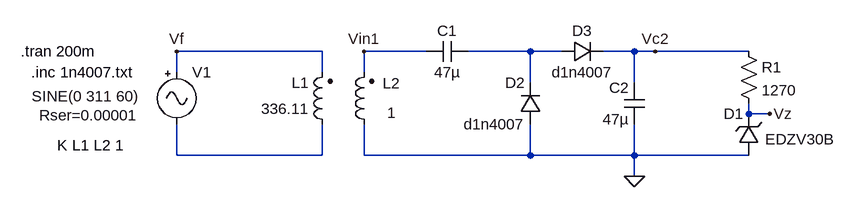
[diagram p0: schematic diodo zener.asc]
diodo zener.asc, the LTspice schematic file:
Version 4
SHEET 1 880 680
WIRE -416 144 -640 144
WIRE -256 144 -352 144
WIRE -96 144 -192 144
WIRE -48 144 -96 144
WIRE 64 144 16 144
WIRE 96 144 64 144
WIRE 240 144 96 144
WIRE -640 176 -640 144
WIRE -416 176 -416 144
WIRE -352 176 -352 144
WIRE -96 192 -96 144
WIRE 64 192 64 144
WIRE 240 240 240 224
WIRE 272 240 240 240
WIRE -640 304 -640 256
WIRE -416 304 -416 256
WIRE -416 304 -640 304
WIRE -352 304 -352 256
WIRE -96 304 -96 256
WIRE -96 304 -352 304
WIRE 64 304 64 256
WIRE 64 304 -96 304
WIRE 240 304 64 304
WIRE 64 336 64 304
FLAG -640 144 Vf
FLAG -352 144 Vin1
FLAG 64 336 0
FLAG 96 144 Vc2
FLAG 272 240 Vz
SYMBOL zener 256 304 R180
WINDOW 0 24 64 Left 2
WINDOW 3 -116 25 Left 2
SYMATTR InstName D1
SYMATTR Value EDZV30B
SYMBOL Misc\\signal -640 160 R0
WINDOW 123 0 0 Left 0
WINDOW 39 -212 82 Left 2
WINDOW 3 -223 53 Left 2
SYMATTR SpiceLine Rser=0.00001
SYMATTR Value SINE(0 311 60)
SYMATTR InstName V1
SYMBOL diode -80 256 R180
WINDOW 0 24 64 Left 2
WINDOW 3 24 0 Left 2
SYMATTR InstName D2
SYMATTR Value d1n4007
SYMBOL ind2 -400 272 R180
WINDOW 0 36 80 Left 2
WINDOW 3 36 40 Left 2
SYMATTR InstName L1
SYMATTR Value 336.11
SYMATTR Type ind
SYMBOL ind2 -336 272 R180
WINDOW 0 -40 79 Left 2
WINDOW 3 -33 34 Left 2
SYMATTR InstName L2
SYMATTR Value 1
SYMATTR Type ind
SYMBOL cap -192 128 R90
WINDOW 0 0 32 VBottom 2
WINDOW 3 32 32 VTop 2
SYMATTR InstName C1
SYMATTR Value 47µ
SYMBOL diode -48 160 R270
WINDOW 0 32 32 VTop 2
WINDOW 3 0 32 VBottom 2
SYMATTR InstName D3
SYMATTR Value d1n4007
SYMBOL cap 80 256 R180
WINDOW 0 24 56 Left 2
WINDOW 3 24 8 Left 2
SYMATTR InstName C2
SYMATTR Value 47µ
SYMBOL res 224 128 R0
SYMATTR InstName R1
SYMATTR Value 1270
TEXT -880 144 Left 2 !.tran 200m
TEXT -824 288 Left 2 !K L1 L2 1
TEXT -864 176 Left 2 !.inc 1n4007.txt

The netlist it stands for:
* diodo zener.asc
D1 0 Vz EDZV30B
V1 Vf N002 SINE(0 311 60) Rser=0.00001
D2 0 N001 d1n4007
L1 N002 Vf 336.11
L2 0 Vin1 1
C1 N001 Vin1 47µ
D3 N001 Vc2 d1n4007
C2 0 Vc2 47µ
R1 Vc2 Vz 1270
.model D D
.lib standard.dio
.tran 200m
K L1 L2 1
.inc 1n4007.txt
.backanno
.end